# Altium schematic sheet BMS.SchDoc
size A3; SheetNumber: 1; SheetTotal: 2
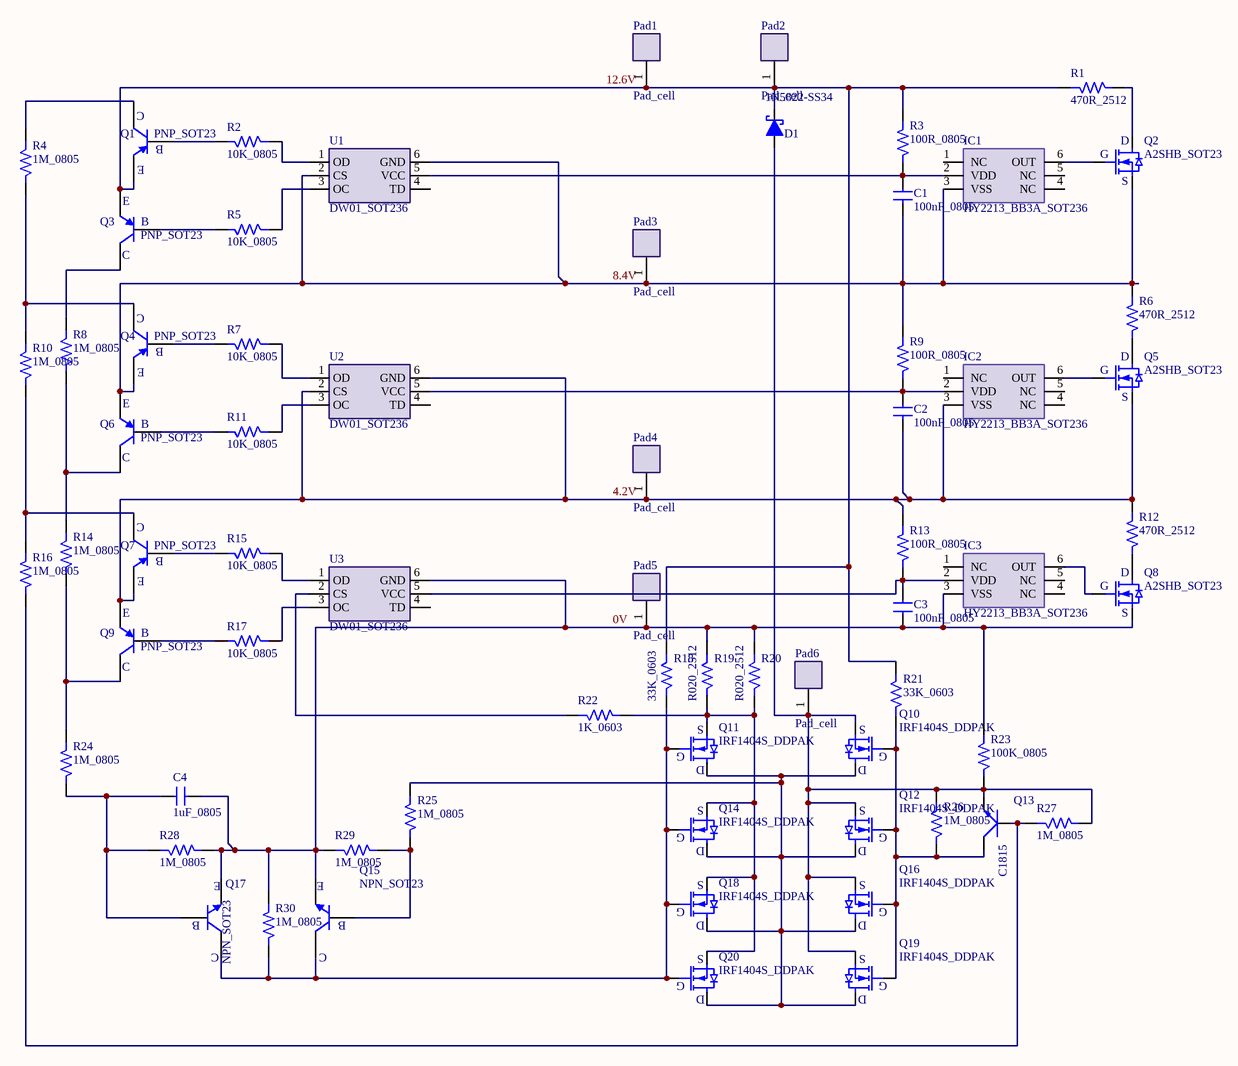
[diagram p0: BMS.SchDoc]

## Parts
C1  100nF_0805  [CN-SMD-0805 - H32]
C2  100nF_0805  [CN-SMD-0805 - H32]
C3  100nF_0805  [CN-SMD-0805 - H32]
C4  1uF_0805  [CN-SMD-0805 - H50]
D1  1N5822-SS34  [SMA]
IC1  HY2213_BB3A_SOT236  [SOT23-6]
IC2  HY2213_BB3A_SOT236  [SOT23-6]
IC3  HY2213_BB3A_SOT236  [SOT23-6]
Pad1  Pad_cell  [Pad_cell]
Pad2  Pad_cell  [Pad_cell]
Pad3  Pad_cell  [Pad_cell]
Pad4  Pad_cell  [Pad_cell]
Pad5  Pad_cell  [Pad_cell]
Pad6  Pad_cell  [Pad_cell]
Q1  PNP_SOT23  [SOT23_3]
Q2  A2SHB_SOT23  [SOT-23-3L]
Q3  PNP_SOT23  [SOT23_3]
Q4  PNP_SOT23  [SOT23_3]
Q5  A2SHB_SOT23  [SOT-23-3L]
Q6  PNP_SOT23  [SOT23_3]
Q7  PNP_SOT23  [SOT23_3]
Q8  A2SHB_SOT23  [SOT-23-3L]
Q9  PNP_SOT23  [SOT23_3]
Q10  IRF1404S_DDPAK  [TO263-3_DDPAK]
Q11  IRF1404S_DDPAK  [TO263-3_DDPAK]
Q12  IRF1404S_DDPAK  [TO263-3_DDPAK]
Q13  C1815  [SOT23B]
Q14  IRF1404S_DDPAK  [TO263-3_DDPAK]
Q15  NPN_SOT23  [SOT23_3]
Q16  IRF1404S_DDPAK  [TO263-3_DDPAK]
Q17  NPN_SOT23  [SOT23_3]
Q18  IRF1404S_DDPAK  [TO263-3_DDPAK]
Q19  IRF1404S_DDPAK  [TO263-3_DDPAK]
Q20  IRF1404S_DDPAK  [TO263-3_DDPAK]
R1  470R_2512  [RES-SMD-2512]
R2  10K_0805  [RES-SMD-0805]
R3  100R_0805  [RES-SMD-0805]
R4  1M_0805  [RES-SMD-0805]
R5  10K_0805  [RES-SMD-0805]
R6  470R_2512  [RES-SMD-2512]
R7  10K_0805  [RES-SMD-0805]
R8  1M_0805  [RES-SMD-0805]
R9  100R_0805  [RES-SMD-0805]
R10  1M_0805  [RES-SMD-0805]
R11  10K_0805  [RES-SMD-0805]
R12  470R_2512  [RES-SMD-2512]
R13  100R_0805  [RES-SMD-0805]
R14  1M_0805  [RES-SMD-0805]
R15  10K_0805  [RES-SMD-0805]
R16  1M_0805  [RES-SMD-0805]
R17  10K_0805  [RES-SMD-0805]
R18  33K_0603  [RES-SMD-0603]
R19  R020_2512  [RES-SMD-2512]
R20  R020_2512  [RES-SMD-2512]
R21  33K_0603  [RES-SMD-0603]
R22  1K_0603  [RES-SMD-0603]
R23  100K_0805  [RES-SMD-0805]
R24  1M_0805  [RES-SMD-0805]
R25  1M_0805  [RES-SMD-0805]
R26  1M_0805  [RES-SMD-0805]
R27  1M_0805  [RES-SMD-0805]
R28  1M_0805  [RES-SMD-0805]
R29  1M_0805  [RES-SMD-0805]
R30  1M_0805  [RES-SMD-0805]
U1  DW01_SOT236  [SOT23-6]
U2  DW01_SOT236  [SOT23-6]
U3  DW01_SOT236  [SOT23-6]

## Nets
0V: C3.1 C4.2 IC3.3(VSS) Pad5.1 Q8.3(S) Q15.2(E) Q17.2(E) R19.2 R20.2 R23.2 R28.1 R29.2 R30.2 U3.6(GND)
4.2V: C2.1 IC2.3(VSS) Pad4.1 Q5.3(S) Q7.2(E) Q9.2(E) R12.2 R13.2 U2.2(CS) U2.6(GND)
8.4V: C1.1 IC1.3(VSS) Pad3.1 Q2.3(S) Q4.2(E) Q6.2(E) R6.2 R9.2 U1.2(CS) U1.6(GND)
12.6V: D1.2(K) Pad1.1 Pad2.1 Q1.2(E) Q3.2(E) R1.2 R3.2 R18.2 R21.1
NetC1_2: C1.2 IC1.2(VDD) R3.1 U1.5(VCC)
NetC2_2: C2.2 IC2.2(VDD) R9.1 U2.5(VCC)
NetC3_2: C3.2 IC3.2(VDD) R13.1 U3.5(VCC)
NetC4_1: C4.1 Q17.1(B) R24.1 R28.2
NetD1_1: D1.1(A) Pad6.1 Q10.3(S) Q12.3(S) Q13.1(E) Q16.3(S) Q19.3(S) R23.1 R26.2 R27.1
NetIC1_6: IC1.6(OUT) Q2.1(G)
NetIC2_6: IC2.6(OUT) Q5.1(G)
NetIC3_6: IC3.6(OUT) Q8.1(G)
NetQ1_1: Q1.1(B) R2.1
NetQ1_3: Q1.3(C) R4.2
NetQ2_2: Q2.2(D) R1.1
NetQ3_1: Q3.1(B) R5.1
NetQ3_3: Q3.3(C) R8.2
NetQ4_1: Q4.1(B) R7.1
NetQ4_3: Q4.3(C) R4.1 R10.2
NetQ5_2: Q5.2(D) R6.1
NetQ6_1: Q6.1(B) R11.1
NetQ6_3: Q6.3(C) R8.1 R14.2
NetQ7_1: Q7.1(B) R15.1
NetQ7_3: Q7.3(C) R10.1 R16.2
NetQ8_2: Q8.2(D) R12.1
NetQ9_1: Q9.1(B) R17.1
NetQ9_3: Q9.3(C) R14.1 R24.2
NetQ10_1: Q10.1(G) Q12.1(G) Q13.2(C) Q16.1(G) Q19.1(G) R21.2 R26.1
NetQ10_2: Q10.2(D) Q11.2(D) Q12.2(D) Q14.2(D) Q16.2(D) Q18.2(D) Q19.2(D) Q20.2(D) R25.2
NetQ11_1: Q11.1(G) Q14.1(G) Q15.3(C) Q17.3(C) Q18.1(G) Q20.1(G) R18.1 R30.1
NetQ11_3: Q11.3(S) Q14.3(S) Q18.3(S) Q20.3(S) R19.1 R20.1 R22.1
NetQ13_3: Q13.3(B) R16.1 R27.2
NetQ15_1: Q15.1(B) R25.1 R29.1
NetR2_2: R2.2 U1.1(OD)
NetR5_2: R5.2 U1.3(OC)
NetR7_2: R7.2 U2.1(OD)
NetR11_2: R11.2 U2.3(OC)
NetR15_2: R15.2 U3.1(OD)
NetR17_2: R17.2 U3.3(OC)
NetR22_2: R22.2 U3.2(CS)

Not connected (* = marked no-connect by the designer): IC1 1(NC) 4(NC) 5(NC); IC2 1(NC) 4(NC) 5(NC); IC3 1(NC) 4(NC) 5(NC); U1 4(TD); U2 4(TD); U3 4(TD)

## Library data of the parts
C1-C3 = CAP 0805 104: Cap SMD, 0.08x0.05 inch, 2.0x1.2 mm - 2012
C4 = CAP 0805 105: Cap SMD, 0.08x0.05 inch, 2.0x1.2 mm - 2012
D1 = Diode 1N5822 SS34: Schottky diode, 3A, VRRM 40V; Code - JEDEC: DO-214-AB; Value: 1N5007; Published: 8-Jun-2000; Revision: July-2002: Re-released for DXP Platform.; Publisher: Altium Limited
IC1-IC3 = HY2213: 1  Cell  Li-ion/Polymer  Battery  Charge  Balance  IC
Q1 Q3 Q4 Q6 Q7 Q9 = MMBT5401: Transistor SMD MMBT5401 PNP 150V - SOT23
Q2 Q5 Q8 = HNM2302ALB: N-Channel / Enhancement Mode / Field Effect Transistor
Q10-Q12 Q14 Q16 Q18-Q20 = IRF1404S: IRF1404S TO263 MOSFET N-CH 162A 40V
Q13 = Transistor C1815: NPN 600mW, ECB; Value: C1815
Q15 Q17 = MMBT5551: 2N5551 MMBT5551 G1 NPN Transistor 0.6A 160V SOT-23
R1 R6 R12 = RES 2512 470R: Resistor SMD, 0.25x0.12 inch, 6.3x3.2 mm - 6332, 1W
R2 R5 R7 R11 R15 R17 = RES 0805 10K: Resistor SMD, 0.08x0.05 inch, 2.0x1.2 mm - 2012, 1/8W
R3 R9 R13 = RES 0805 100R: Resistor SMD, 0.08x0.05 inch, 2.0x1.2 mm - 2012, 1/8W
R4 R8 R10 R14 R16 R24-R30 = RES 0805 1M: Resistor SMD, 0.08x0.05 inch, 2.0x1.2 mm - 2012, 1/8W
R18 R21 = RES 0603 33K: Resistor SMD, 0.06x0.03 inch, 1.55x0.85 mm - 1608, 1/10W
R19 R20 = RES 2512 0.02R: Resistor SMD, 0.25x0.12 inch, 6.3x3.2 mm - 6332, 1W
R22 = RES 0603 1K: Resistor SMD, 0.06x0.03 inch, 1.55x0.85 mm - 1608, 1/10W
R23 = RES 0805 100K: Resistor SMD, 0.08x0.05 inch, 2.0x1.2 mm - 2012, 1/8W
U1-U3 = DW01: One Cell Lithium-ion/Polymer Battery Protection IC